# EAGLE design 4A adjustable (EAGLE 9.6.2)
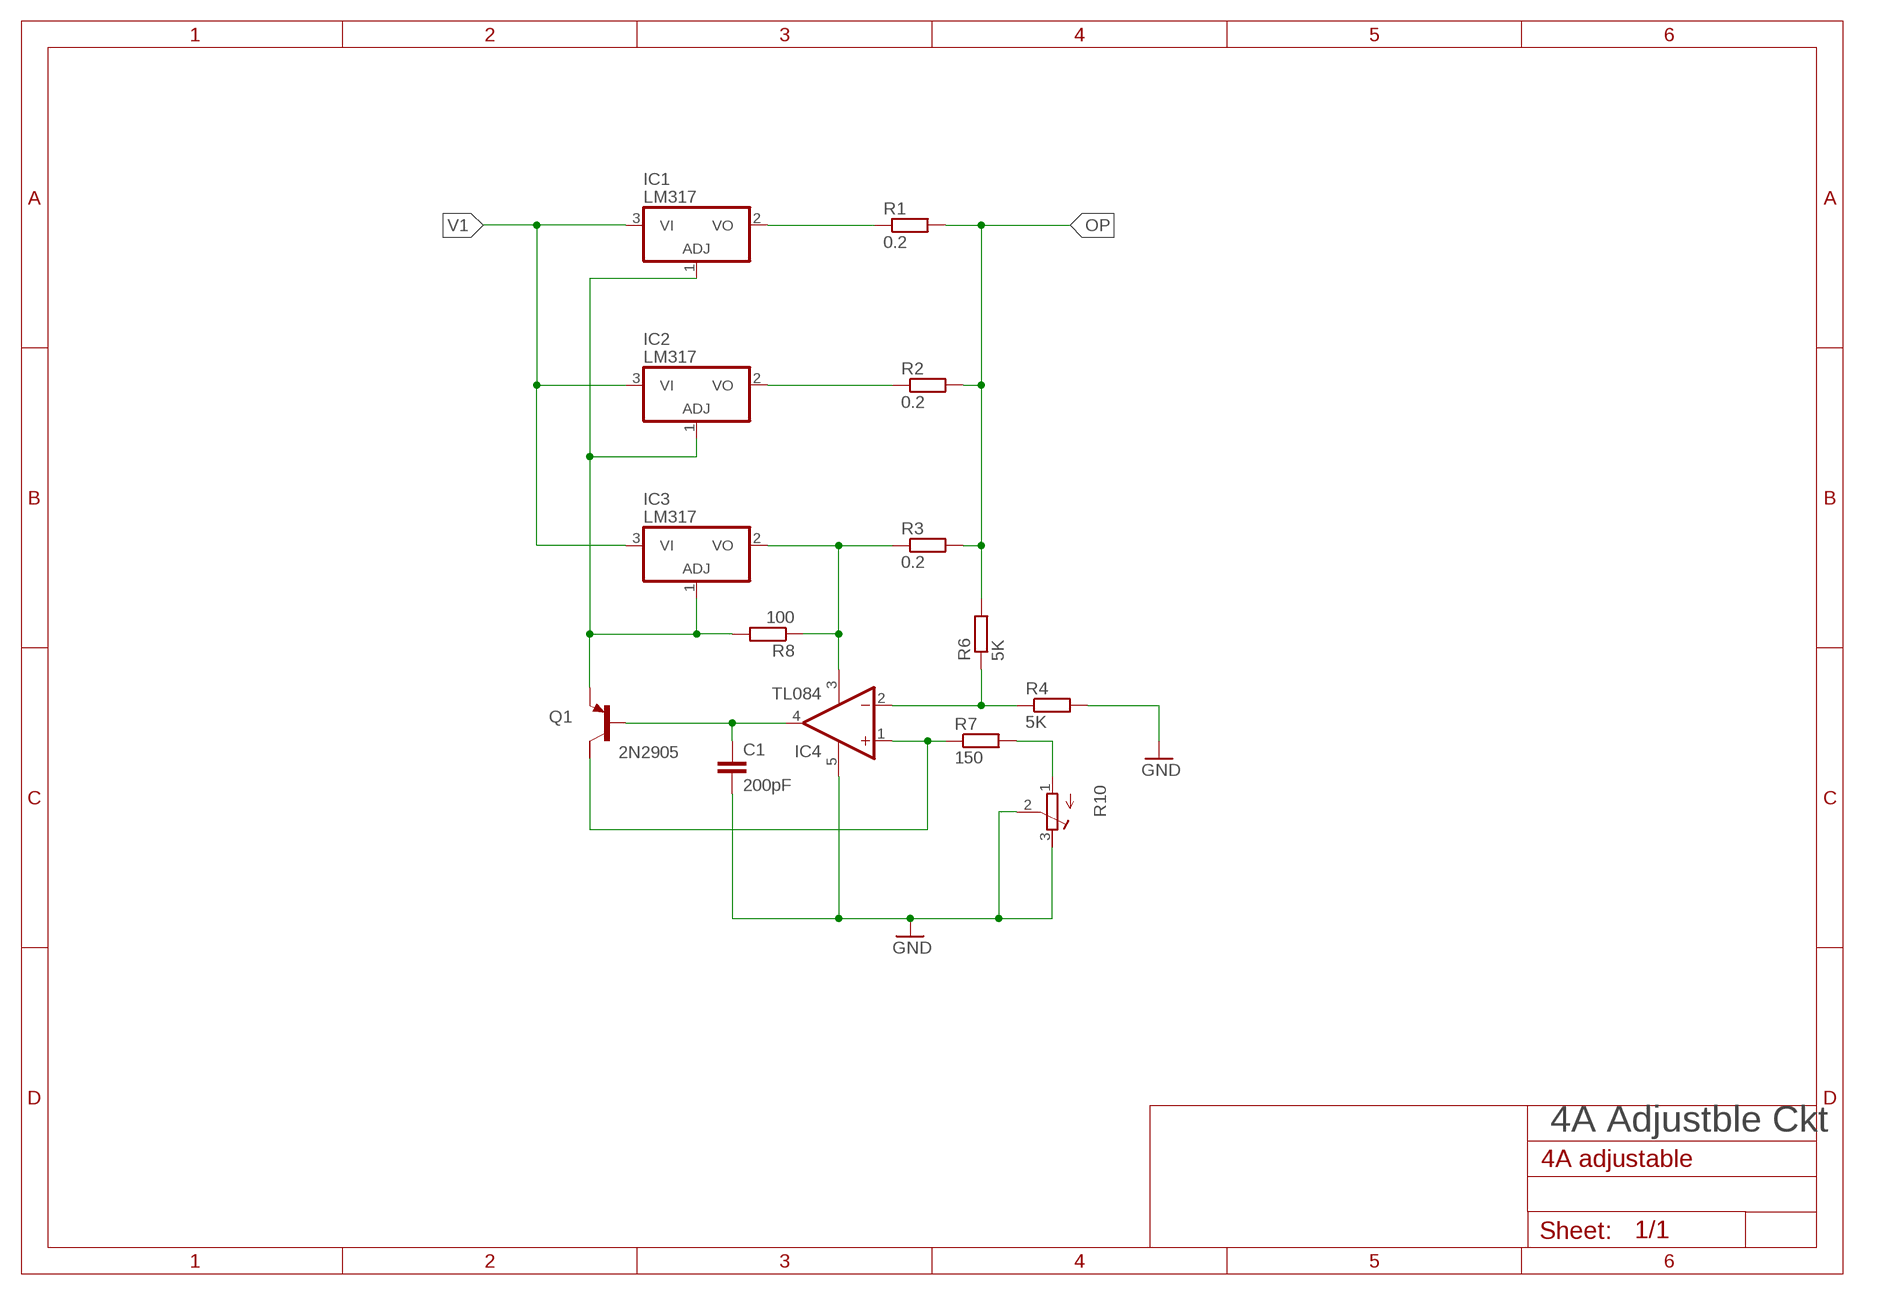
[diagram p0: schematic, sheet 1]

## Parts
C1  200pF  C-EU025-025X050  [C025-025X050]
IC1  LM317  LM317LZ  [TO92]
IC2  LM317  LM317LZ  [TO92]
IC3  LM317  LM317LZ  [TO92]
IC4  TL084  L165ST  [CB360]
Q1  2N2905  PNP-TRANSISTIOR-2COLSOT89  [SOT89]
R1  0.2  R-EU_0207/10  [0207/10]
R2  0.2  R-EU_0207/10  [0207/10]
R3  0.2  R-EU_0207/10  [0207/10]
R4  5K  R-EU_0207/10  [0207/10]
R6  5K  R-EU_0207/10  [0207/10]
R7  150  R-EU_0207/10  [0207/10]
R8  100  R-EU_0207/10  [0207/10]
R10  R-TRIMM3339P  [RTRIM3339P]

## Nets
GND: C1.2 IC4.5(V+) R4.2 R10.2(S) R10.3(E)
N$2: IC3.2(VO) IC4.3(GND) R3.1 R8.1
N$3: IC1.1(ADJ) IC2.1(ADJ) IC3.1(ADJ) Q1.3(E) R8.2
N$5: IC4.2(-IN) R4.1 R6.1
N$6: IC1.2(VO) R1.1
N$7: IC2.2(VO) R2.1
N$9: IC4.1(+IN) Q1.2(C) R7.1
N$10: C1.1 IC4.4(OUT) Q1.1(B)
N$13: R7.2 R10.1(A)
OP: R1.2 R2.2 R3.2 R6.2
V1: IC1.3(VI) IC2.3(VI) IC3.3(VI)
Unconnected: Q1.2@1(C/)

## Notes on the sheet
- 4A Adjustble Ckt

## Library data of the parts
C1 = rcl:C-EU: CAPACITOR, European symbol; SPICEPREFIX: C
IC1-IC3 = linear:*317: Positive VOLTAGE REGULATOR
IC4 = linear:L165ST: OP AMP
Q1 = semicon-smd-ipc:PNP-TRANSISTIOR-2COL: PNP TRANSISTOR 2 colletor pins
R1-R4 R6-R8 = rcl:R-EU_: RESISTOR, European symbol; SPICEPREFIX: R
R10 = rcl:R-TRIMM: Trimm resistor; SPICEMODEL: X; SPICEPREFIXL: POT

## Board
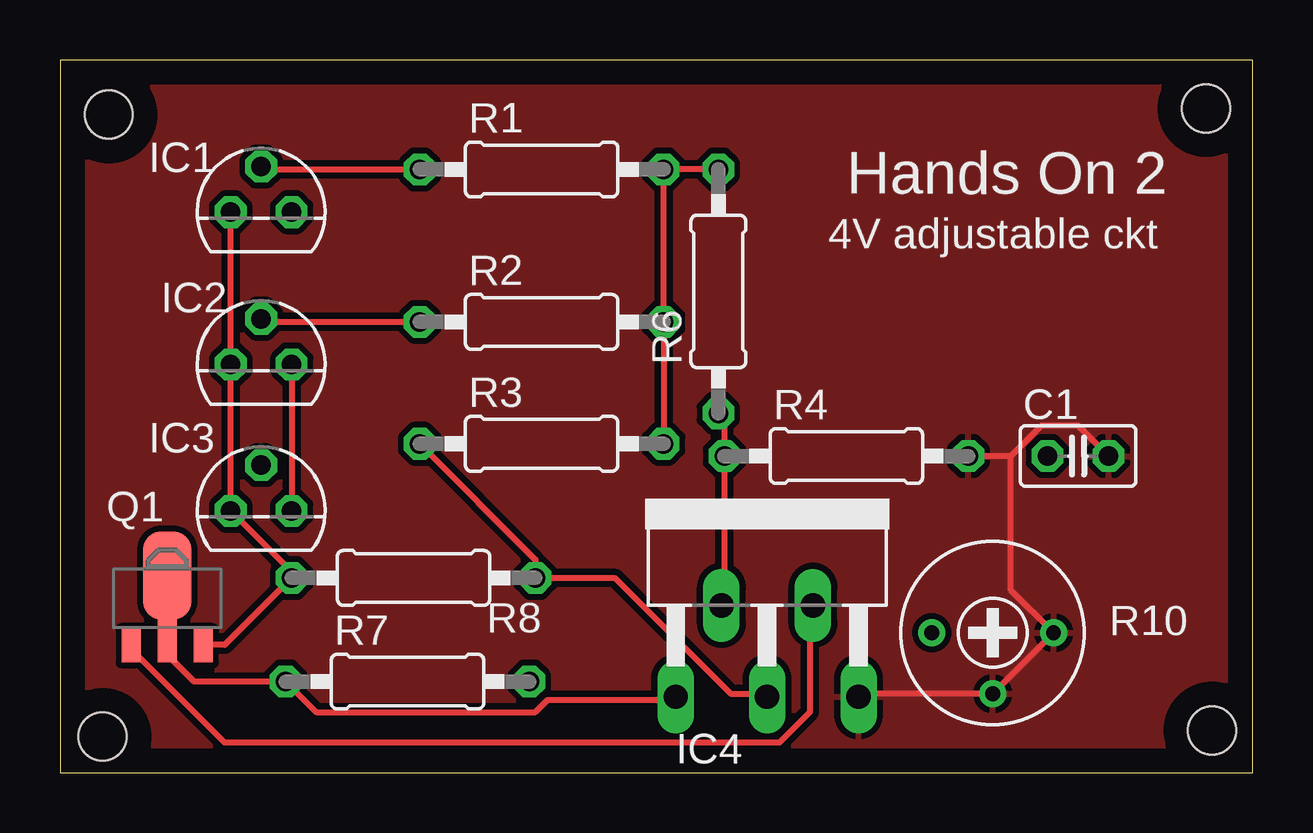
[diagram p1: board, top side]
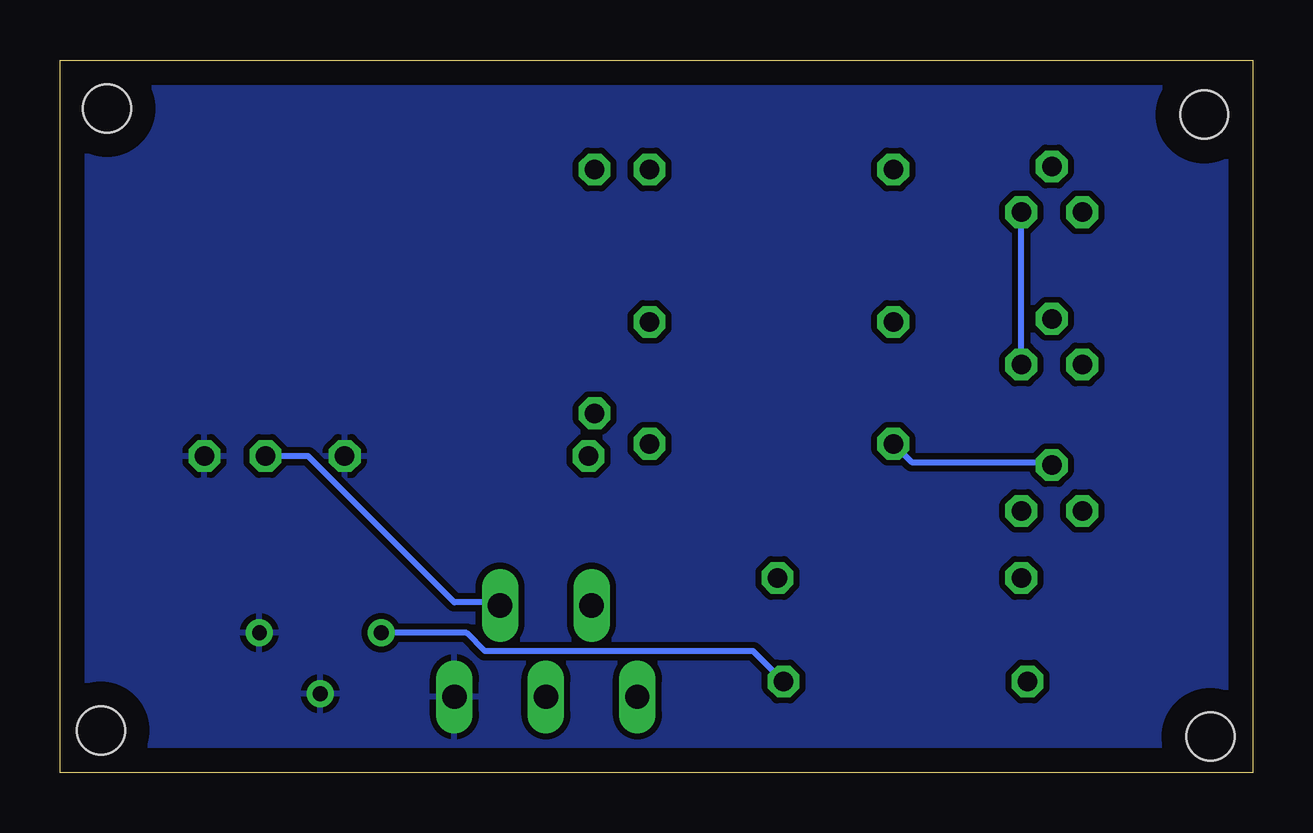
[diagram p2: board, bottom side, seen from below]

Size 49.71 x 29.71 mm. Coordinates in mm from the lower left corner, seen from the top.
Outline: 0,0 49.71,0 49.71,29.71 0,29.71 0,0
Copper layers (1*16): Top 0.035mm / dielectric 1.5mm / Bottom 0.035mm
Design rules "default *": minimum track width 10mil, minimum drill 0.35mm, track to track 10mil, track to pad 10mil, pad to pad 10mil, via to via 10mil, smd to smd 10mil, copper to edge 40mil, drill to drill 10mil, minimum pad ring 10mil, minimum via ring 8mil, stop-mask expansion 4mil, vias tented up to drill 0mil, thermal gap 10mil
Holes 2 mm at 2.03,27.43 47.75,27.69 48.01,1.78 1.78,1.52

### Footprints (pad centres in the part's own frame; a part is rotated, then mirrored left to right if it is on the bottom)
C025-025X050 = drill 0.813 octagon: 1 -1.27,0; 2 1.27,0
TO92 = drill 0.813 octagon: 1 -1.27,0; 2 0,1.905; 3 1.27,0
CB360 = drill 1.016 long: 1 -3.81,-8.255; 2 -1.905,-4.445; 3 0,-8.255; 4 1.905,-4.445; 5 3.81,-8.255
SOT89 = smd 0.8 x 1.4: 1 -1.499,-1.981; 3 1.499,-1.981 | smd 0.8 x 1.9: 2 0,-1.727 | smd 2.032 x 3.65: 2@1 0,0.94
0207/10 = drill 0.813 octagon: 1 -5.08,0; 2 5.08,0
RTRIM3339P = drill 0.61: 1 -2.54,0; 2 0,-2.54; 3 2.54,0

### Placement (x,y rotation side)
C1  42.42,13.21 0 top
IC1  8.38,23.37 0 top
IC2  8.38,17.02 0 top
IC3  8.38,10.92 0 top
IC4  29.46,11.43 0 top
Q1  4.47,7.29 0 top
R1  20.07,25.15 0 top
R2  20.07,18.8 0 top
R3  20.07,13.72 0 top
R4  32.77,13.21 0 top
R6  27.43,20.07 90 top
R7  14.48,3.81 0 top
R8  14.73,8.13 180 top
R10  38.86,5.84 0 top

### Tracks (layer width: path | path; a pad name or v marks a point on that pad's centre or on a via)
GND
  Top 0.254: 39.62,13.21 R4.2 | 39.62,13.21 40.89,14.48 42.42,14.48 C1.2 | IC4.5 33.27,3.3 R10.2 R10.3 39.62,7.62 39.62,13.21
  pour Top: -0.36,30.12 50.42,30.12 50.42,-0.38 -0.43,-0.38 -0.43,-0.23 -0.43,30.05 -0.56,30.05
  pour Bottom: -0.99,30.78 51.21,30.78 51.21,-1.09 50.5,-1.09 -1.07,-1.09 -1.07,30.78
N$2
  Top 0.254: R3.1 19.81,8.89 R8.1 23.11,8.13 27.94,3.3 29.46,3.3 IC4.3
  Bottom 0.254: R3.1 14.22,12.95 8.38,12.95 IC3.2
N$3
  Top 0.254: Q1.3 6.1,5.33 6.86,5.33 R8.2 9.65,8.38 IC3.1 IC2.1 IC1.1
N$5
  Top 0.254: R6.1 27.69,14.73 R4.1 27.69,7.11 IC4.2
N$6
  Top 0.254: R1.1 8.38,25.15 IC1.2
N$7
  Top 0.254: R2.1 8.38,18.8 IC2.2
N$9
  Top 0.254: Q1.2 4.57,5.33 4.57,4.83 5.59,3.81 R7.1 10.67,2.54 19.81,2.54 20.32,3.05 25.65,3.05 IC4.1
N$10
  Top 0.254: Q1.1 3.05,5.08 6.86,1.27 29.97,1.27 31.24,2.54 31.24,6.86 IC4.4
  Bottom 0.254: C1.1 39.37,13.21 33.27,7.11 31.5,7.11 IC4.4
N$13
  Bottom 0.254: R10.1 32.77,5.84 32,5.08 20.83,5.08 R7.2
OP
  Top 0.254: R6.2 R1.2 R2.2 R3.2
V1
  Top 0.254: IC2.3 IC3.3
  Bottom 0.254: IC2.3 IC1.3

### Text on the board
tPlace: Hands On 2 | 4V adjustable ckt